# Altium schematic sheet NewThermocouple.SchDoc
size A4; SheetNumber: 9; SheetTotal: 9
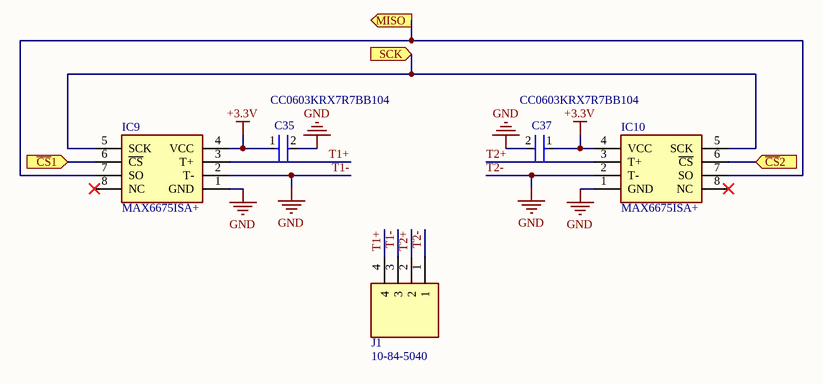
[diagram p0: NewThermocouple.SchDoc]

## Parts
C35  CC0603KRX7R7BB104  [FP-CC0603-DA-MFG]
C37  CC0603KRX7R7BB104  [FP-CC0603-DA-MFG]
IC9  MAX6675ISA+  [SOIC127P600X175-8N]
IC10  MAX6675ISA+  [SOIC127P600X175-8N]
J1  10-84-5040  [10845040]

## Ports
MISO (out), SCK (in), ~{CS}1 (in), ~{CS}2 (in)

## Nets
+3.3V: C35.1 C37.1 IC9.4(VCC) IC10.4(VCC)
T1-: C35.2 C37.2 IC9.1(GND) IC9.2(T-) IC10.1(GND) IC10.2(T-) J1.1 J1.3  [also labelled GND, T2-]
~{CS}1: IC9.6(~{CS}) ; port ~{CS}1
~{CS}2: IC10.6(~{CS}) ; port ~{CS}2
MISO: IC9.7(SO) IC10.7(SO) ; port MISO
SCK: IC9.5(SCK) IC10.5(SCK) ; port SCK
T1+: IC9.3(T+) J1.4
T2+: IC10.3(T+) J1.2

Not connected (* = marked no-connect by the designer): IC9 8(NC)*; IC10 8(NC)*

## Library data of the parts
C35 C37 = CMP-2000-05002-2: CAP CER 0.1UF 16V X7R 0603; Manufacturer: YAGEO; Tolerance: 0.1; Value: 100 nF; Temperature Coefficient: 15%; Material: Ceramic; Voltage Rating: 16 V; Package: CC0603-DA; ComponentLink2Description: Datasheet; Octopart: https://octopart.com/cc0603krx7r7bb104-yageo-192941; Temperature Range High: +125°C; Digikey Description: CAP CER 0.1UF 16V X7R 0603; Voltage: 16 V; Device Class L2: Capacitors; Height: 0.9mm; Temperature: -55°C to +125°C; Manufacturer Part Number: CC0603KRX7R7BB104; Device Class L1: Passive Components; Device Class L3: Ceramic Capacitors; ComponentLink2URL: http://www.yageo.com/documents/recent/UPY-GPHC_X7R_6.3V-to-50V_18.pdf; Footprint Url: http://www.yageo.com/exep/pages/download/literatures/UPY-C_GEN_24.pdf; RoHS: TRUE; Temperature Range Low: -55°C; Temperature Characteristic: X7R; Lead Free: Yes; Capacitance: 100 nF; Category: Cap; Mouser Description: Multilayer Ceramic Capacitor, CC Series, 0.1 - F, - 10%, X7R, 16 V, 0603 [1608 Metric]; Automotive: No
IC9 IC10 = MAX6675ISA+: Integrated Circuit; Manufacturer_Name: Maxim Integrated; Datasheet Link: https://componentsearchengine.com//MAX6675ISA+.pdf; Height: 1.75mm; Mouser2 Part Number: 700-MAX6675ISA; Mouser2 Price/Stock: https://www.mouser.com/Search/Refine.aspx?Keyword=700-MAX6675ISA; Manufacturer_Part_Number: MAX6675ISA+
J1 = 10-84-5040: Connector; Manufacturer_Name: Molex; Datasheet Link: https://www.molex.com/pdm_docs/sd/010845040_sd.pdf; Height: 14.22mm; Manufacturer_Part_Number: 10-84-5040